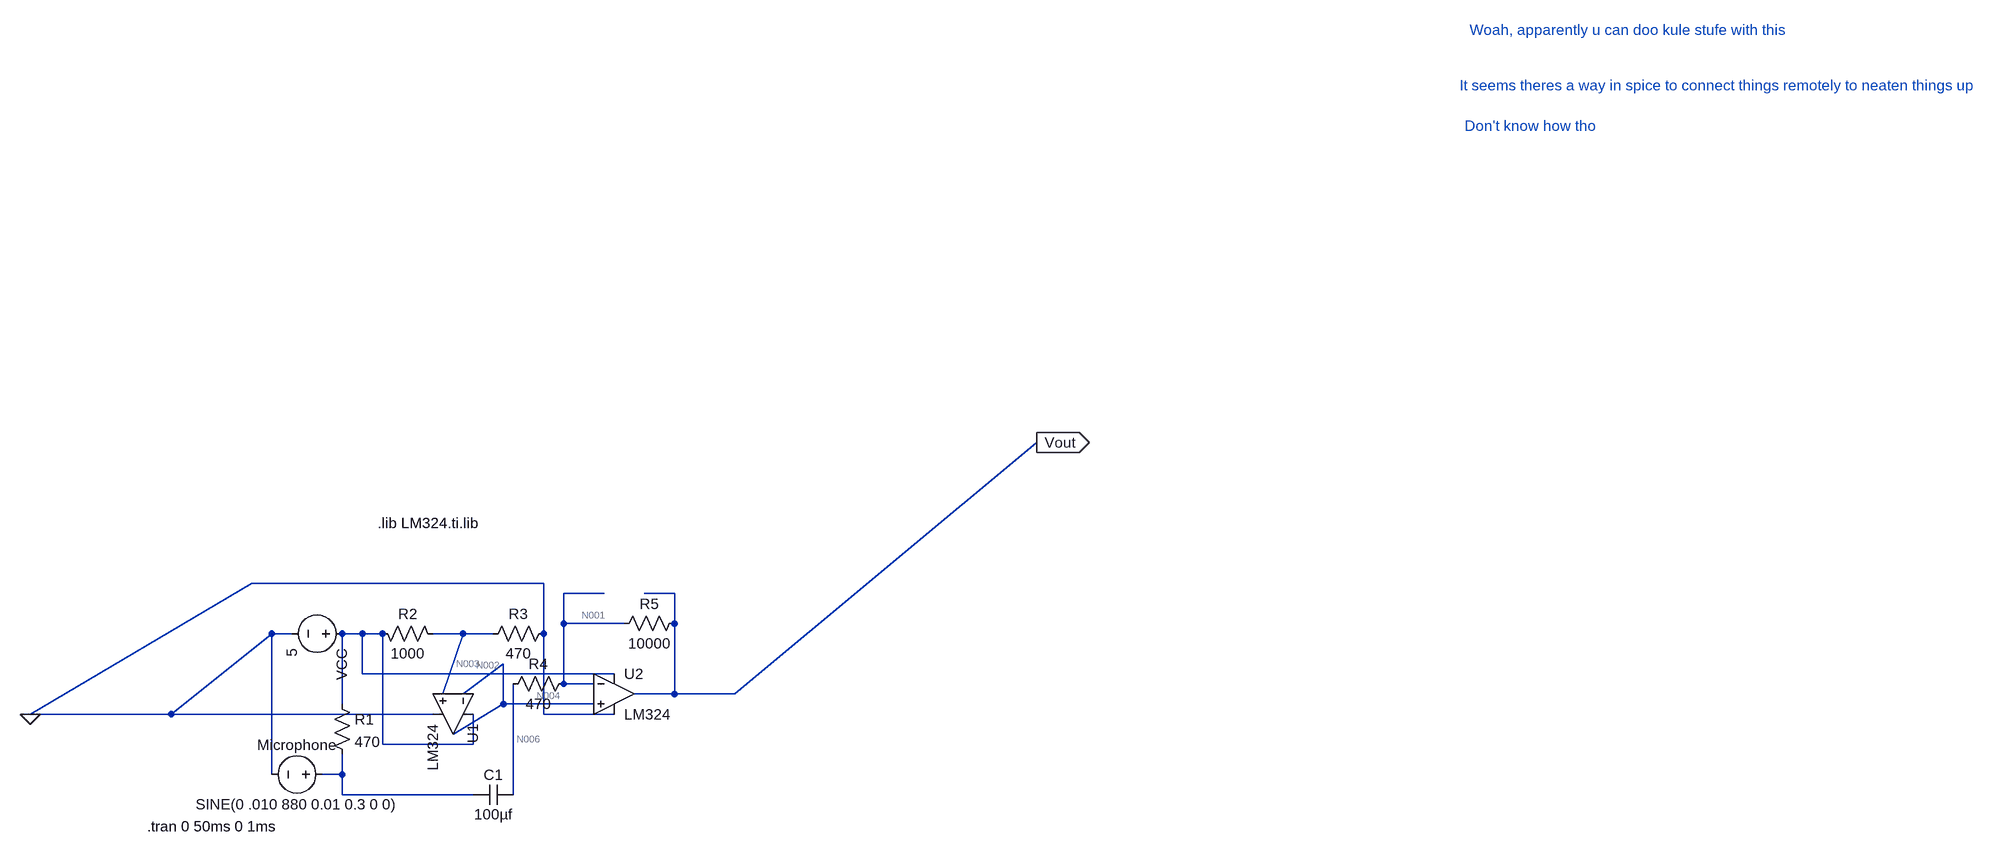
[diagram p0: schematic Mic Preamp.asc]
Mic Preamp.asc, the LTspice schematic file:
Version 4
SHEET 1 3084 680
WIRE 624 -272 160 -272
WIRE 720 -256 656 -256
WIRE 832 -256 784 -256
WIRE 656 -208 656 -256
WIRE 752 -208 656 -208
WIRE 832 -208 832 -256
WIRE 224 -192 192 -192
WIRE 336 -192 304 -192
WIRE 368 -192 336 -192
WIRE 496 -192 448 -192
WIRE 544 -192 496 -192
WIRE 624 -192 624 -272
WIRE 336 -128 336 -192
WIRE 736 -128 336 -128
WIRE 656 -112 656 -208
WIRE 704 -112 656 -112
WIRE 464 -96 496 -192
WIRE 496 -96 560 -144
WIRE 832 -96 832 -208
WIRE 832 -96 768 -96
WIRE 928 -96 1408 -496
WIRE 928 -96 832 -96
WIRE 304 -80 304 -192
WIRE 560 -80 560 -144
WIRE 704 -80 560 -80
WIRE -192 -64 160 -272
WIRE 32 -64 192 -192
WIRE 32 -64 -192 -64
WIRE 448 -64 32 -64
WIRE 624 -64 624 -192
WIRE 736 -64 624 -64
WIRE 480 -32 560 -80
WIRE 368 -16 368 -192
WIRE 512 -16 512 -64
WIRE 512 -16 368 -16
WIRE 192 32 192 -192
WIRE 304 32 304 0
WIRE 304 32 272 32
WIRE 304 64 304 32
WIRE 512 64 304 64
WIRE 576 64 576 -112
FLAG 1408 -496 Vout
IOPIN 1408 -496 Out
FLAG -192 -64 0
SYMBOL voltage 320 -192 R90
WINDOW 123 0 0 Left 2
WINDOW 39 0 0 Left 2
SYMATTR InstName VCC
SYMATTR Value 5
SYMBOL voltage 288 32 R90
WINDOW 0 -32 56 VBottom 2
WINDOW 3 32 56 VTop 2
WINDOW 123 0 0 Left 2
WINDOW 39 0 0 Left 2
SYMATTR InstName Microphone
SYMATTR Value SINE(0 .010 880 0.01 0.3 0 0)
SYMBOL res 288 -96 R0
SYMATTR InstName R1
SYMATTR Value 470
SYMBOL res 672 -128 R90
WINDOW 0 0 56 VBottom 2
WINDOW 3 32 56 VTop 2
SYMATTR InstName R4
SYMATTR Value 470
SYMBOL res 848 -224 R90
WINDOW 0 0 56 VBottom 2
WINDOW 3 32 56 VTop 2
SYMATTR InstName R5
SYMATTR Value 10000
SYMBOL res 464 -176 M270
WINDOW 0 32 56 VTop 2
WINDOW 3 0 56 VBottom 2
SYMATTR InstName R2
SYMATTR Value 1000
SYMBOL res 640 -208 R90
WINDOW 0 0 56 VBottom 2
WINDOW 3 32 56 VTop 2
SYMATTR InstName R3
SYMATTR Value 470
SYMBOL cap 576 48 R90
WINDOW 0 0 32 VBottom 2
WINDOW 3 32 32 VTop 2
SYMATTR InstName C1
SYMATTR Value 100µf
SYMBOL Opamps\\opamp2 544 -64 R90
SYMATTR InstName U1
SYMATTR Value LM324
SYMBOL Opamps\\opamp2 736 -160 R0
SYMATTR InstName U2
SYMATTR Value LM324
TEXT 360 -368 Left 2 !.lib LM324.ti.lib
TEXT 2096 -1152 Left 2 ;Woah, apparently u can doo kule stufe with this
TEXT 2080 -1064 Left 2 ;It seems theres a way in spice to connect things remotely to neaten things up
TEXT 2088 -1000 Left 2 ;Don't know how tho
TEXT -6 114 Left 2 !.tran 0 50ms 0 1ms

The netlist it stands for:
* Mic Preamp.asc
VCC N002 0 5
V§Microphone N005 0 SINE(0 .010 880 0.01 0.3 0 0)
R1 N002 N005 470
R4 N001 N006 470
R5 Vout N001 10000
R2 N003 N002 1000
R3 0 N003 470
C1 N006 N005 100µf
XU1 N003 N004 N002 0 N004 LM324  ; pins In+ In- V+ V- OUT
XU2 N004 N001 N002 0 Vout LM324  ; pins In+ In- V+ V- OUT
.lib LM324.ti.lib
* Woah, apparently u can doo kule stufe with this
* It seems theres a way in spice to connect things remotely to neaten things up
* Don't know how tho
.tran 0 50ms 0 1ms
.backanno
.end

* Results of the author's LTspice run, read from the files saved beside the schematic
* Operating Point, zero values left out:
*   V(n002) = 5 V
*   V(n001) = 1.599 V
*   V(n006) = 1.599 V
*   V(vout) = 1.598 V
*   V(n003) = 1.599 V
*   V(n004) = 1.599 V
*   I(R3) = -3.401 mA
*   I(R2) = -3.401 mA
*   I(R5) = -20.02 nA
*   I(R1) = 10.64 mA
*   I(Microphone) = 10.64 mA
*   I(Vcc) = -14.39 mA
*   Ix(u1:1) = -20.04 nA
*   Ix(u1:2) = -20.02 nA
*   Ix(u1:3) = 175 µA
*   Ix(u1:4) = -175 µA
*   Ix(u1:5) = 40.06 nA
*   Ix(u2:1) = -20.04 nA
*   Ix(u2:2) = -20.02 nA
*   Ix(u2:3) = 175 µA
*   Ix(u2:4) = -175 µA
*   Ix(u2:5) = 20.02 nA